# EAGLE design xbee (EAGLE 5.11)
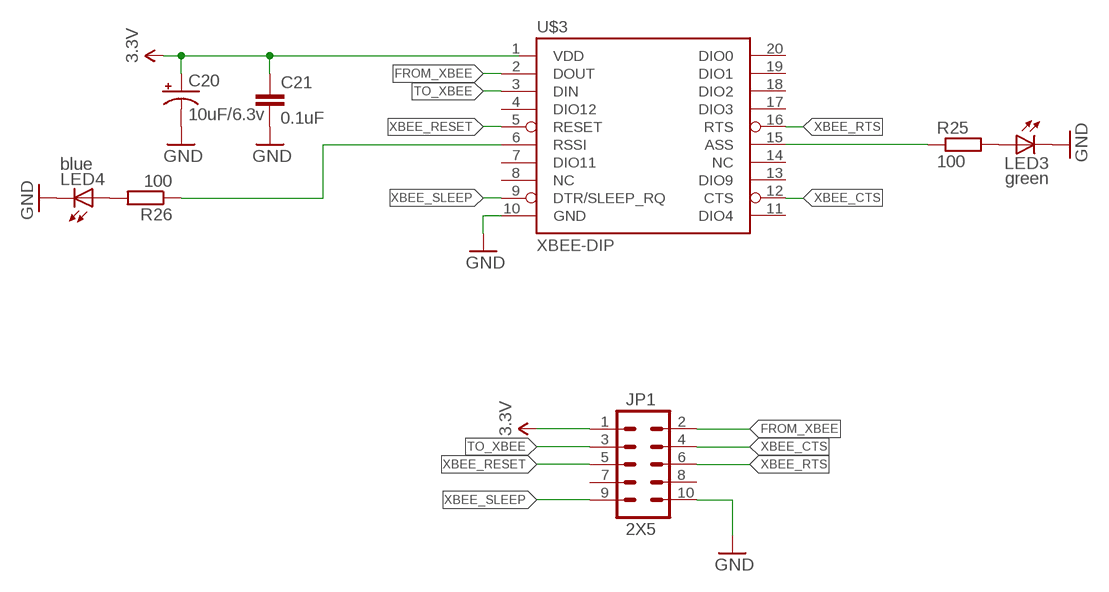
[diagram p0: schematic, sheet 1]

## Parts
C20  10uF/6.3v  CAP_POL3528  [EIA3528]
C21  0.1uF  CAP0805  [0805]
JP1  2X5  [2X5-PSEUDOSMD]
LED3  green  LED0805  [LED-0805]
LED4  blue  LED0805  [LED-0805]
R25  100  R-EU_M0805  [M0805]
R26  100  R-EU_M0805  [M0805]
U$3  XBEE-DIP  [XBEE-SILK]

## Nets
3.3V: C20.A(+) C21.1 JP1.1 U$3.1(VDD)
FROM_XBEE: JP1.2 U$3.2(DOUT)
GND: C20.C(-) C21.2 JP1.10 LED3.C LED4.C U$3.10(GND)
N$21: LED3.A R25.2
N$22: R25.1 U$3.15(ASS)
N$23: LED4.A R26.2
N$24: R26.1 U$3.6(RSSI)
TO_XBEE: JP1.3 U$3.3(DIN)
XBEE_CTS: JP1.4 U$3.12(CTS)
XBEE_RESET: JP1.5 U$3.5(RESET)
XBEE_RTS: JP1.6 U$3.16(RTS)
XBEE_SLEEP: JP1.9 U$3.9(DTR/SLEEP_RQ)
Unconnected: JP1.7 JP1.8 U$3.4(DIO12) U$3.7(DIO11) U$3.8(NC) U$3.11(DIO4) U$3.13(DIO9) U$3.14(NC) U$3.17(DIO3) U$3.18(DIO2) U$3.19(DIO1) U$3.20(DIO0)

## Library data of the parts
C20 = SparkFun:CAP_POL: Capacitor Polarized These are standard SMD and PTH capacitors. Normally 10uF, 47uF, and 100uF in electrolytic and tantalum varieties. Always verify the external diameter of the through hole cap, it varies with capacity, voltage, and manufacturer. The EIA devices should be standard.
C21 = SparkFun:CAP: Capacitor Standard 0603 ceramic capacitor, and 0.1" leaded capacitor.
JP1 = barthess:2X5
LED3 LED4 = barthess:LED: LEDs Standard schematic elements and footprints for 5mm, 3mm, 1206, and 0603 sized LEDs. 5mm - Spark Fun Electronics SKU : COM-00529 (and others)
R25 R26 = rcl:R-EU_: RESISTOR, European symbol
U$3 = barthess:XBEE

## Board
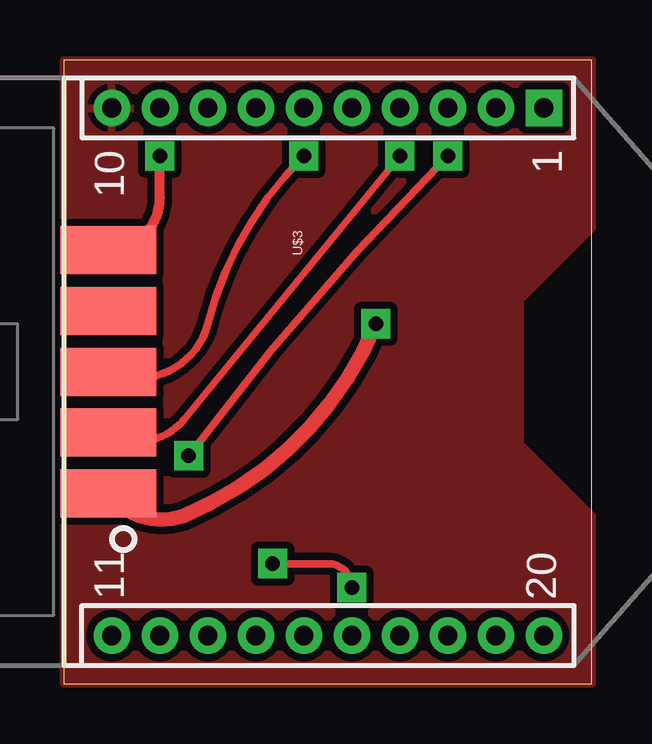
[diagram p1: board, top side]
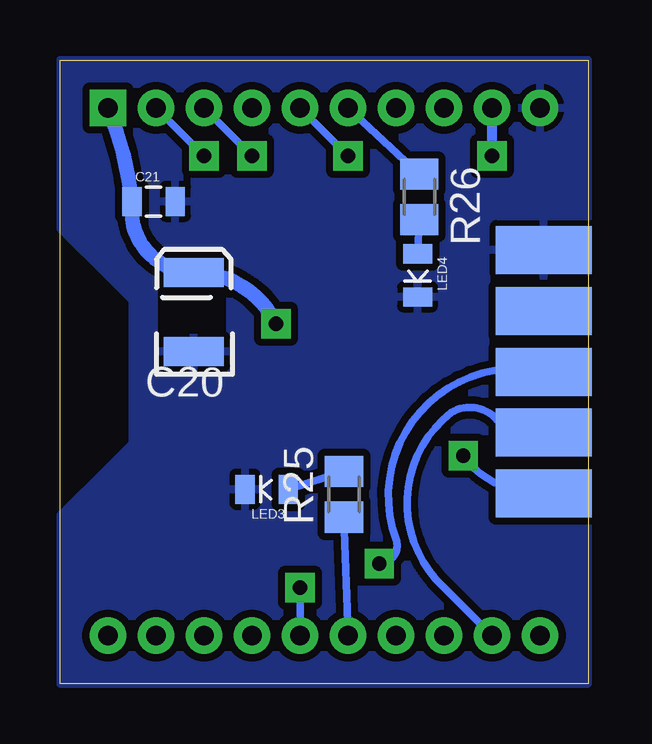
[diagram p2: board, bottom side, seen from below]

Size 22 x 26 mm. Coordinates in mm from the lower left corner, seen from the top.
Outline: 0,0 22,0 22,26 0,26 0,0
Copper layers (1*16): Top 0.035mm / dielectric 1.5mm / Bottom 0.035mm
Design rules "default *": minimum track width 12mil, minimum drill 32mil, track to track 12mil, track to pad 12mil, pad to pad 12mil, via to via 12mil, smd to smd 8mil, copper to edge 0mil, drill to drill 40mil, minimum pad ring 12mil, minimum via ring 12mil, stop-mask expansion 4mil, vias tented up to drill 0mil, thermal gap 10mil
bRestrict: area 15.1,14.6 to 17.9,16.2; area 2.2,12.6 to 2.4,12.7

### Footprints (pad centres in the part's own frame; a part is rotated, then mirrored left to right if it is on the bottom)
EIA3528 = smd 1.2 x 2.5: A 1.65,0; C -1.65,0
0805 = smd 0.8 x 1.2: 1 -0.9,0; 2 0.9,0
2X5-PSEUDOSMD = smd 4 x 2: 1 0,5.08; 3 0,2.54; 5 0,0; 7 0,-2.54; 9 0,-5.08 | smd 4 x 2 bottom: 2 0,5.08; 4 0,2.54; 6 0,0; 8 0,-2.54; 10 0,-5.08
LED-0805 = smd 0.8 x 1.2: A -0.9,0; C 0.9,0
M0805 = smd 1.3 x 1.6: 1 -0.95,0; 2 0.95,0
XBEE-SILK = drill 0.8 pad 1.524 square: 1 -11,20 | drill 0.8 pad 1.524 round: 2 -11,18; 3 -11,16; 4 -11,14; 5 -11,12; 6 -11,10; 7 -11,8; 8 -11,6; 9 -11,4; 10 -11,2; 11 11,2; 12 11,4; 13 11,6; 14 11,8; 15 11,10; 16 11,12; 17 11,14; 18 11,16; 19 11,18; 20 11,20

### Placement (x,y rotation side)
C20  16.42,15.49 90 bottom
C21  18.1,20.1 0 bottom
JP1  1.84,13 180 top
LED3  13.39,8.1 180 bottom
LED4  7.1,17.02 270 bottom
R25  10.17,7.89 90 bottom
R26  7.03,20.29 270 bottom
U$3  0,13 270 top

### Tracks (layer width: path | path; a pad name or v marks a point on that pad's centre or on a via)
3.3V  (via drill 0.6)
  Top 0.61: v13,15 arc-45 5,7 arc-71 JP1.1
  Bottom 0.61: U$3.1 arc16 C21.1 arc-98 C20.A arc64 v13,15
FROM_XBEE  (via drill 0.6)
  Top 0.305: v5.2,9.5 arc-8 v16,22
  Bottom 0.305: 2.42,8.5 JP1.2 arc56 v5.2,9.5 | v16,22 U$3.2
GND
  pour Bottom: 0,26 22,26 22,19 19,16 19,10 22,7 22,0 0,0
  pour Top: 0,26 22,26 22,19 19,16 19,10 22,7 22,0 0,0
N$21
  Bottom 0.305: R25.2 LED3.A
N$22
  Bottom 0.305: U$3.15 R25.1
N$23
  Bottom 0.305: R26.2 LED4.A
N$24
  Bottom 0.305: R26.1 U$3.6
TO_XBEE  (via drill 0.6)
  Top 0.305: 2.38,11 JP1.3 arc82 5,11 v14,22
  Bottom 0.305: v14,22 U$3.3
XBEE_CTS
  Bottom 0.305: U$3.12 6,4 arc99 5.7,11.3 arc81 3.8,11 arc-43 JP1.4
XBEE_RESET  (via drill 0.6)
  Top 0.305: v10,22 arc31 6,15 arc-100 JP1.5
  Bottom 0.305: v10,22 U$3.5
XBEE_RTS  (via drill 0.6)
  Top 0.305: v12,4 arc90 11,5 v8.7,5
  Bottom 0.305: U$3.16 v12,4 | v8.7,5 arc-110 8,6 arc123 JP1.6
XBEE_SLEEP  (via drill 0.6)
  Top 0.406: JP1.9 arc90 4,20.24 v4,22
  Bottom 0.406: v4,22 U$3.9